# EAGLE design displayshield_v1 (EAGLE 6.3)
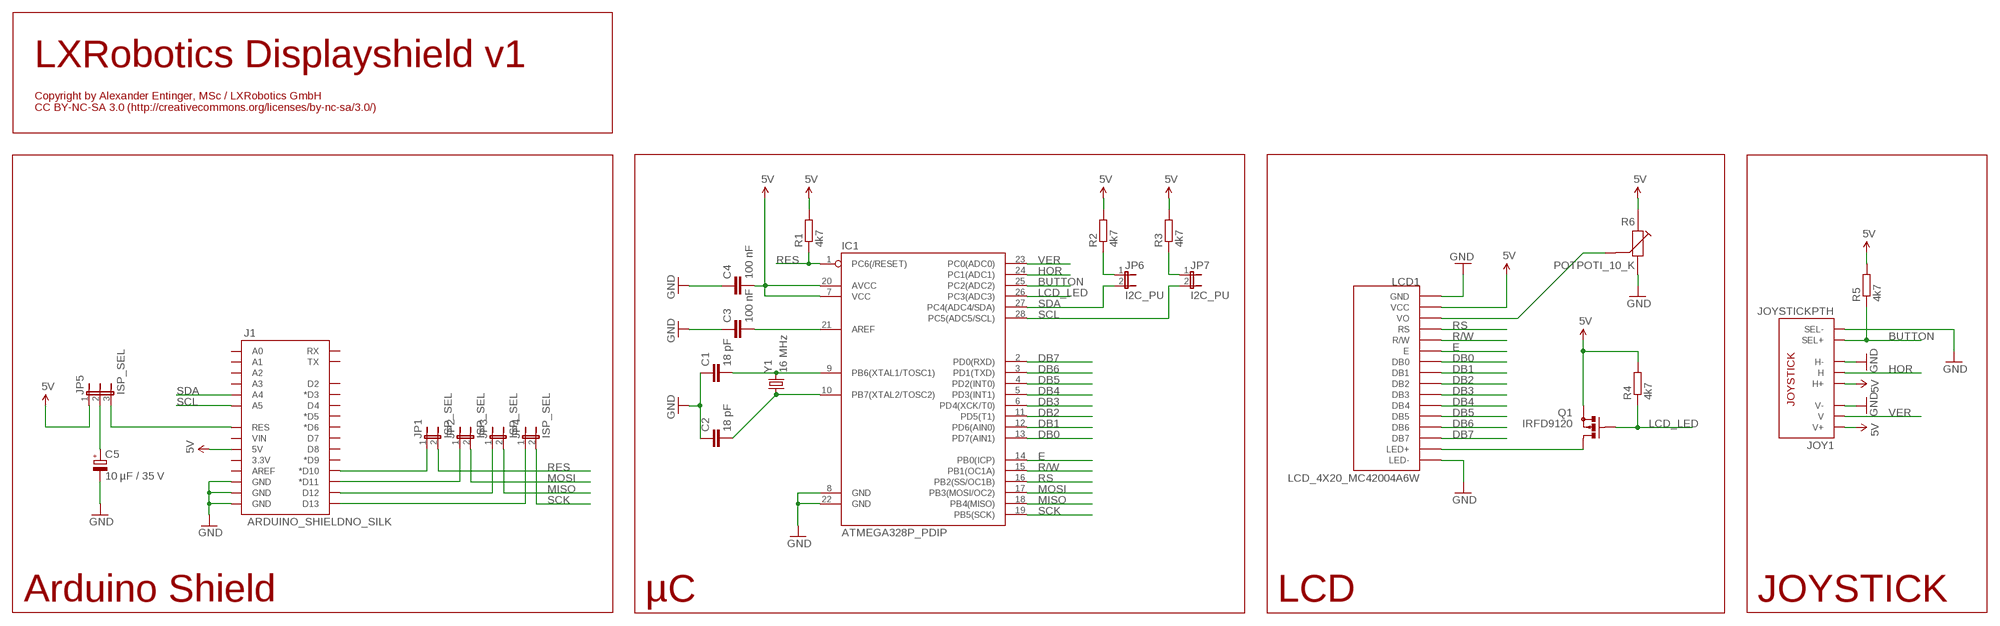
[diagram p0: schematic, sheet 1]

## Parts
C1  18 pF  C-EU025-025X050  [C025-025X050]
C2  18 pF  C-EU025-025X050  [C025-025X050]
C3  100 nF  C-EU025-025X050  [C025-025X050]
C4  100 nF  C-EU025-025X050  [C025-025X050]
C5  10 µF / 35 V  CPOL-EUE2-5  [E2-5]
IC1  ATMEGA328P_PDIP  [DIL28-3]
J1  ARDUINO_SHIELDNO_SILK  [DUEMILANOVE_VIAS]
JOY1  JOYSTICKPTH  [JOYSTICK]
JP1  ISP_SEL  JP1E  [JP1]
JP2  ISP_SEL  JP1E  [JP1]
JP3  ISP_SEL  JP1E  [JP1]
JP4  ISP_SEL  JP1E  [JP1]
JP5  ISP_SEL  JP2E  [JP2]
JP6  I2C_PU  JP1E  [JP1]
JP7  I2C_PU  JP1E  [JP1]
LCD1  LCD_4X20_MC42004A6W  [LCD_3X40_MC42004A6W]
Q1  IRFD9120  [C370-01]
R1  4k7  R-EU_0204/5  [0204/5]
R2  4k7  R-EU_0204/5  [0204/5]
R3  4k7  R-EU_0204/5  [0204/5]
R4  4k7  R-EU_0204/5  [0204/5]
R5  4k7  R-EU_0204/5  [0204/5]
R6  POTPOTI_10_K  [POT_10K]
Y1  16 MHz  CRYSTALHC49US  [HC49US]

## Nets
5V: C4.2 IC1.7(VCC) IC1.20(AVCC) J1.5V JOY1.H1(H+) JOY1.V1(V+) JP5.1 LCD1.VCC Q1.S R1.2 R2.2 R3.2 R4.2 R5.2 R6.S
BUTTON: IC1.25(PC2(ADC2)) JOY1.B1A(SEL+) R5.1
DB0: IC1.13(PD7(AIN1)) LCD1.DB0
DB1: IC1.12(PD6(AIN0)) LCD1.DB1
DB2: IC1.11(PD5(T1)) LCD1.DB2
DB3: IC1.6(PD4(XCK/T0)) LCD1.DB3
DB4: IC1.5(PD3(INT1)) LCD1.DB4
DB5: IC1.4(PD2(INT0)) LCD1.DB5
DB6: IC1.3(PD1(TXD)) LCD1.DB6
DB7: IC1.2(PD0(RXD)) LCD1.DB7
E: IC1.14(PB0(ICP)) LCD1.E
GND: C1.1 C2.1 C3.1 C4.1 C5.- IC1.8(GND) IC1.22(GND) J1.GND@0(GND) J1.GND@1(GND) J1.GND@2(GND) JOY1.B2A(SEL-) JOY1.H3(H-) JOY1.V3(V-) LCD1.GND LCD1.LED- R6.E
HOR: IC1.24(PC1(ADC1)) JOY1.H2(H)
LCD_LED: IC1.26(PC3(ADC3)) Q1.G R4.1
MISO: IC1.18(PB4(MISO)) JP3.2
MOSI: IC1.17(PB3(MOSI/OC2)) JP2.2
N$1: C2.2 IC1.10(PB7(XTAL2/TOSC2)) Y1.1
N$2: C1.2 IC1.9(PB6(XTAL1/TOSC1)) Y1.2
N$3: J1.D10(*D10) JP1.1
N$4: J1.D11(*D11) JP2.1
N$5: C3.2 IC1.21(AREF)
N$6: J1.D12 JP3.1
N$7: J1.D13 JP4.1
N$8: C5.+ JP5.2
N$9: LCD1.LED+ Q1.D Q1.D1(D)
N$10: LCD1.VO R6.VAR
N$11: J1.RES JP5.3
N$12: JP6.1 R2.1
N$13: JP7.1 R3.1
R/W: IC1.15(PB1(OC1A)) LCD1.R/W
RES: IC1.1(PC6(/RESET)) JP1.2 R1.1
RS: IC1.16(PB2(SS/OC1B)) LCD1.RS
SCK: IC1.19(PB5(SCK)) JP4.2
SCL: IC1.28(PC5(ADC5/SCL)) J1.A5 JP7.2
SDA: IC1.27(PC4(ADC4/SDA)) J1.A4 JP6.2
VER: IC1.23(PC0(ADC0)) JOY1.V2(V)
Unconnected: J1.3.3V J1.A0 J1.A1 J1.A2 J1.A3 J1.AREF J1.D2 J1.D3(*D3) J1.D4 J1.D5(*D5) J1.D6(*D6) J1.D7 J1.D8 J1.D9(*D9) J1.RX J1.TX J1.VIN

## Notes on the sheet
- LXRobotics Displayshield v1
- Copyright by Alexander Entinger, MSc / LXRobotics GmbH 
  CC BY-NC-SA 3.0 (http://creativecommons.org/licenses/by-nc-sa/3.0/)
- Arduino Shield | µC | LCD | JOYSTICK

## Library data of the parts
C1-C4 = resistor:C-EU: CAPACITOR, European symbol
C5 = resistor:CPOL-EU: POLARIZED CAPACITOR, European symbol
IC1 = SparkFun-DigitalIC:ATMEGA328P_PDIP: uC used in the Arduino 32kb flash, 1k EEPROM, 2k SRAM This is the through-hole version of this chip.
J1 = SparkFun-Boards:ARDUINO_SHIELD: Arduino shield footprint
JOY1 = SparkFun-Electromechanical:JOYSTICK: Thumb Joystick Joystick commonly found in PS2 controllers. Two pots and a select switch. Footprint proven. Spark Fun Electronics SKU : COM-09032
JP1-JP4 JP6 JP7 = jumper:JP1E: JUMPER
JP5 = jumper:JP2E: JUMPER
LCD1 = lxrobotics:LCD_4X20_MC42004A6W
Q1 = transistor-small-signal:IRFD9120: P-CHANNEL MOS FET
R1-R5 = resistor:R-EU_: RESISTOR, European symbol
R6 = lxrobotics:POT
Y1 = SparkFun-FreqCtrl:CRYSTAL: Various standard crystals. Proven footprints. Spark Fun Electronics SKU : COM-00534

## Board
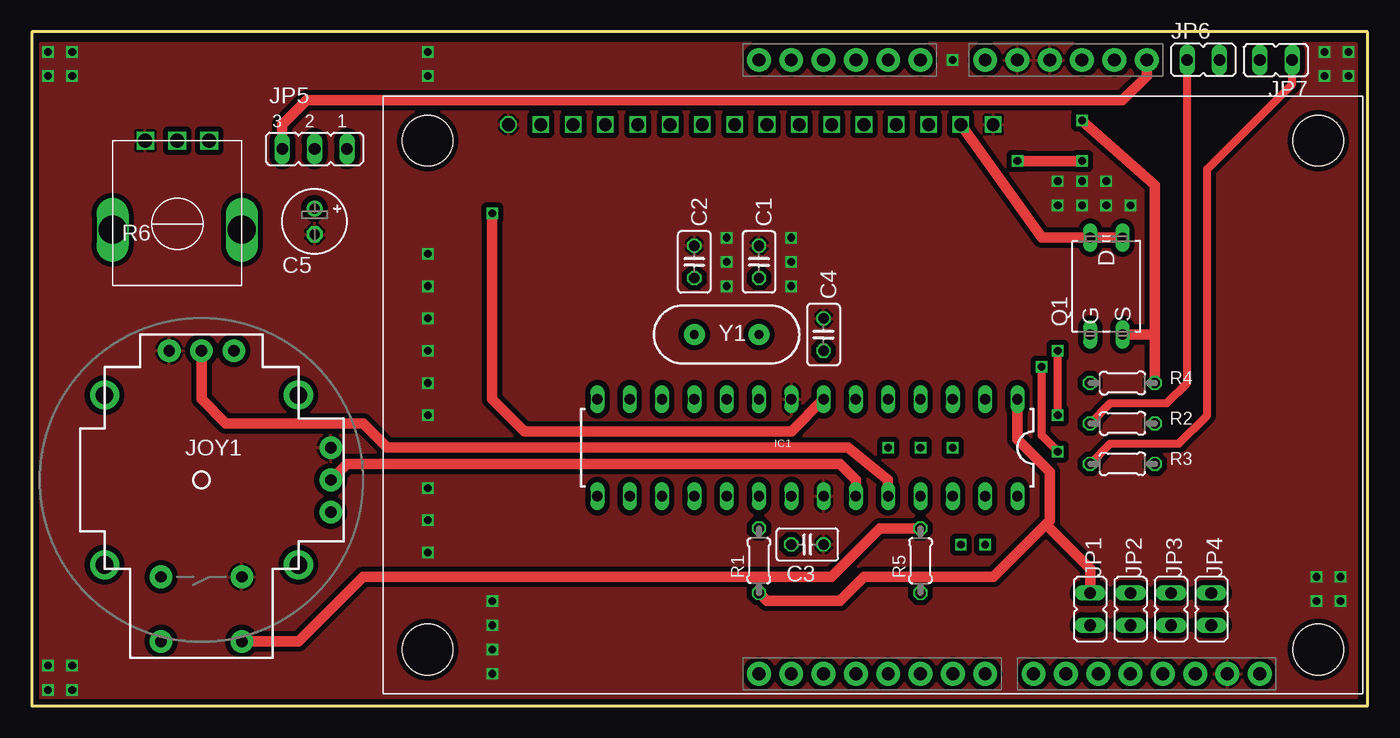
[diagram p1: board, top side]
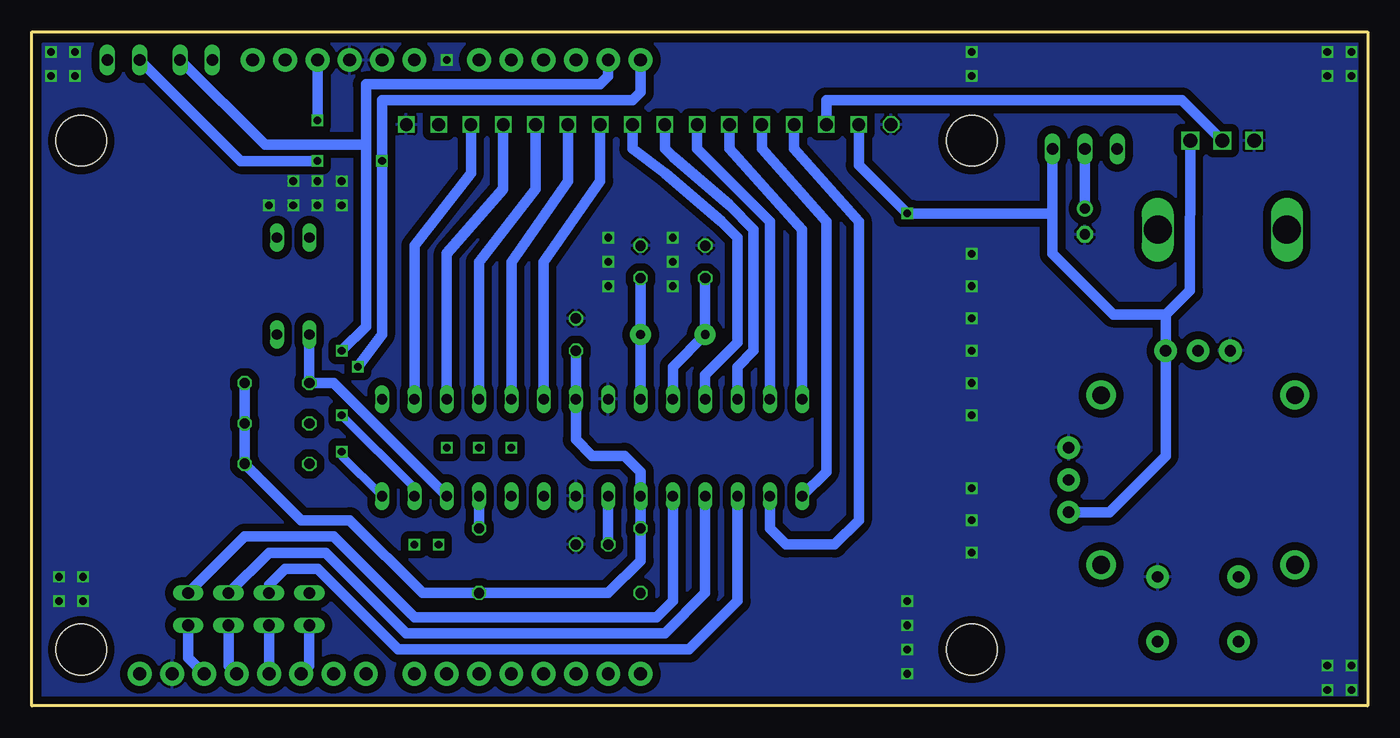
[diagram p2: board, bottom side, seen from below]

Size 105 x 53 mm. Coordinates in mm from the lower left corner, seen from the top.
Outline: 0,0 105,0 105,53 0,53 0,0
Copper layers (1*16): Top 0.035mm / dielectric 1.5mm / Bottom 0.035mm
Design rules "LeitOn - Standard-Eagle-DRU - 1- und  2-Lagen DK - deutsch - Rev 2.0": minimum track width 0.15mm, minimum drill 0.3mm, track to track 0.15mm, track to pad 0.15mm, pad to pad 0.15mm, via to via 0.15mm, smd to smd 0.15mm, copper to edge 0.3mm, drill to drill 0.3mm, minimum pad ring 0.15mm, minimum via ring 0.15mm, stop-mask expansion 0.075mm, vias tented up to drill 0mil, thermal gap 0.2mm

### Footprints (pad centres in the part's own frame; a part is rotated, then mirrored left to right if it is on the bottom)
C025-025X050 = drill 0.813 octagon: 1 -1.27,0; 2 1.27,0
E2-5 = drill 0.813 pad 1.27: + -1.016,0 | drill 0.813 pad 1.27 octagon: - 1.016,0
DIL28-3 = drill 0.813 long: 1 -16.51,-3.81; 2 -13.97,-3.81; 3 -11.43,-3.81; 4 -8.89,-3.81; 5 -6.35,-3.81; 6 -3.81,-3.81; 7 -1.27,-3.81; 8 1.27,-3.81; 9 3.81,-3.81; 10 6.35,-3.81; 11 8.89,-3.81; 12 11.43,-3.81; 13 13.97,-3.81; 14 16.51,-3.81; 15 16.51,3.81; 16 13.97,3.81; 17 11.43,3.81; 18 8.89,3.81; 19 6.35,3.81; 20 3.81,3.81; 21 1.27,3.81; 22 -1.27,3.81; 23 -3.81,3.81; 24 -6.35,3.81; 25 -8.89,3.81; 26 -11.43,3.81; 27 -13.97,3.81; 28 -16.51,3.81
DUEMILANOVE_VIAS = drill 1.016 pad 1.88: 3.3V 50.8,13.97; 5V 50.8,16.51; A0 50.8,29.21; A1 50.8,31.75; A2 50.8,34.29; A3 50.8,36.83; A4 50.8,39.37; A5 50.8,41.91; AREF 2.54,2.54; D2 2.54,36.83; D3 2.54,34.29; D4 2.54,31.75; D5 2.54,29.21; D6 2.54,26.67; D7 2.54,24.13; D8 2.54,20.32; D9 2.54,17.78; D10 2.54,15.24; D11 2.54,12.7; D12 2.54,10.16; D13 2.54,7.62; GND@0 50.8,19.05; GND@1 50.8,21.59; GND@2 2.54,5.08; RES 50.8,11.43; RX 2.54,41.91; TX 2.54,39.37; VIN 50.8,24.13
JOYSTICK = drill 0.9 pad 1.778: B1A -3.175,12.7; B1B 3.175,12.7; B2A -3.175,7.62; B2B 3.175,7.62 | drill 0.889 pad 1.778: H1 -2.54,-10.16; H2 0,-10.16; H3 2.54,-10.16; V1 -10.16,2.54; V2 -10.16,0; V3 -10.16,-2.54 | drill 1.397 pad 2.286: MOUNT1 -7.62,6.668; MOUNT2 -7.62,-6.668; MOUNT3 7.62,-6.668; MOUNT4 7.62,6.668
JP1 = drill 0.914 long: 1 0,-1.27; 2 0,1.27
JP2 = drill 0.914 long: 1 -2.54,0; 2 0,0; 3 2.54,0
LCD_3X40_MC42004A6W = drill 1 square: DB0 -2.54,1.27; DB1 0,1.27; DB2 2.54,1.27; DB3 5.08,1.27; DB4 7.62,1.27; DB5 10.16,1.27; DB6 12.7,1.27; DB7 15.24,1.27; E -5.08,1.27; LED+ 17.78,1.27; LED- 20.32,1.27; R/W -7.62,1.27; RS -10.16,1.27; VCC -15.24,1.27; VO -12.7,1.27 | drill 1 octagon: GND -17.78,1.27 | hole 4: -24.13,0; 45.87,0; -24.13,-40; 45.87,-40
C370-01 = drill 0.813 long: D -3.81,1.27; D1 -3.81,-1.27; G 3.81,-1.27; S 3.81,1.27
0204/5 = drill 0.813 octagon: 1 -2.54,0; 2 2.54,0
POT_10K = drill 1.1 square: E 2.5,0; S -2.5,0; VAR 0,0 | drill 2.2 long: P$1 -5.08,7; P$2 5.08,7
HC49US = drill 0.7 pad 1.651: 1 -2.54,0; 2 2.54,0

### Placement (x,y rotation side)
C1  57.15,34.91 270 top
C2  52.07,34.91 270 top
C3  60.96,12.68 180 top
C4  62.23,29.2 270 top
C5  22.23,38.09 270 top
IC1  60.96,20.3 180 top
J1  99.06,-0.01 90 top
JOY1  13.34,17.77 180 top
JP1  83.19,7.61 0 top
JP2  86.36,7.61 0 top
JP3  89.53,7.61 0 top
JP4  92.71,7.61 0 top
JP5  22.23,43.8 180 top
JP6  92.08,50.78 270 top
JP7  97.79,50.78 90 top
LCD1  55.24,44.44 0 top
Q1  84.45,33.01 270 top
R1  57.15,11.41 90 top
R2  85.72,22.21 0 top
R3  85.72,19.04 0 top
R4  85.72,25.38 0 top
R5  69.85,11.41 270 top
R6  11.43,44.44 180 top
Y1  54.61,29.2 0 top

### Tracks (layer width: path | path; a pad name or v marks a point on that pad's centre or on a via)
5V  (via drill 0.6)
  Top 0.813: v36.2,38.72 36.2,24.11 38.73,21.57 59.69,21.57 IC1.7 | v82.55,46.02 88.27,40.94 88.27,29.2 | 88.27,29.2 R4.2 | Q1.S 88.27,29.2
  Bottom 0.813: R4.2 R2.2 R3.2 83.82,14.59 80.01,14.59 74.3,8.88 R5.2 59.69,8.88 57.15,11.41 R1.2 IC1.20 57.15,18.4 58.42,19.67 60.96,19.67 62.23,20.94 IC1.7 C4.2 | JOY1.V1 20.32,15.23 15.88,19.67 JOY1.H1 15.88,30.78 | 15.88,30.78 13.97,32.65 R6.S | JP5.1 24.77,38.72 | 24.77,38.72 24.77,35.55 20,30.78 15.88,30.78 | LCD1.VCC 40.01,42.53 v36.2,38.72 24.77,38.72 | J1.5V v82.55,46.02
BUTTON
  Top 0.813: R5.1 66.67,13.95 62.87,10.14 26.04,10.14 20.95,5.06 JOY1.B1A
  Bottom 0.813: R5.1 IC1.25
DB0
  Bottom 0.813: LCD1.DB0 52.7,43.8 46.99,38.09 IC1.13
DB1
  Bottom 0.813: LCD1.DB1 55.24,43.8 54.61,43.16 50.16,39.35 48.26,37.45 48.26,27.92 49.53,26.66 IC1.12
DB2
  Bottom 0.813: LCD1.DB2 57.78,43.8 55.24,41.9 50.8,38.09 49.53,36.81 49.53,28.56 52.07,26.02 IC1.11
DB3
  Bottom 0.813: IC1.6 64.77,34.91 60.33,41.26 LCD1.DB3
DB4
  Bottom 0.813: IC1.5 67.31,34.91 62.87,41.26 LCD1.DB4
DB5
  Bottom 0.813: IC1.4 69.85,34.91 65.41,40.62 LCD1.DB5
DB6
  Bottom 0.813: IC1.3 72.39,35.55 67.94,40.62 LCD1.DB6
DB7
  Bottom 0.813: IC1.2 74.93,36.18 70.48,41.9 LCD1.DB7
E
  Bottom 0.813: LCD1.E 50.16,43.8 44.45,37.45 IC1.14
GND  (via drill 0.6)
  other vias: 1.27,51.42 3.17,51.42 3.17,49.52 1.27,49.52 1.27,3.16 3.17,3.16 3.17,1.26 1.27,1.26 36.2,2.53 36.2,4.43 36.2,6.34 36.2,8.24 31.11,12.05 31.11,14.59 31.11,17.13 31.11,22.84 31.11,25.38 31.11,27.92 31.11,30.47 31.11,33.01 31.11,35.55 31.11,49.52 31.11,51.42 72.39,50.78 86.36,39.35 80.64,41.26 80.64,39.35 82.55,39.35 82.55,41.26 84.45,41.26 84.45,39.35 101.6,51.42 103.5,51.42 103.5,49.52 101.6,49.52 54.61,36.81 54.61,34.91 54.61,33.01 59.69,33.01 59.69,34.91 59.69,36.81 102.87,10.14 102.87,8.24 100.97,8.24 100.97,10.14
  pour Bottom (isolate 0.61): 0.64,0.62 104.14,0.62 104.14,52.05 0.64,52.05
  pour Top (isolate 0.406): 0.64,0.62 104.14,0.62 104.14,52.05 0.64,52.05
HOR
  Top 0.813: IC1.24 67.31,17.77 64.14,20.3 27.94,20.3 26.04,22.21 15.24,22.21 13.34,24.11 JOY1.H2
LCD_LED
  Bottom 0.813: IC1.26 81.28,25.38 R4.1 Q1.G
MISO
  Bottom 0.813: JP3.2 86.36,12.05 81.92,12.05 75.56,5.7 55.24,5.7 52.07,8.88 IC1.18
MOSI
  Bottom 0.813: JP2.2 86.36,9.51 85.09,10.78 82.55,10.78 76.2,4.43 53.34,4.43 49.53,8.24 IC1.17
N$1
  Bottom 0.813: IC1.10 54.61,26.66 Y1.1 C2.2
N$2
  Bottom 0.813: C1.2 Y1.2 IC1.9
N$3
  Bottom 0.813: J1.D10 83.19,3.16 JP1.1
N$4
  Bottom 0.813: JP2.1 J1.D11
N$5
  Bottom 0.813: IC1.21 C3.2
N$6
  Bottom 0.813: JP3.1 89.53,3.16 J1.D12
N$7
  Bottom 0.813: JP4.1 92.71,3.79 J1.D13
N$8
  Bottom 0.813: JP5.2 C5.+
N$9
  Top 0.813: Q1.D Q1.D1 79.38,36.81 LCD1.LED+
N$10
  Bottom 0.813: LCD1.VO 42.55,47.61 14.61,47.61 R6.VAR
N$11
  Top 0.813: J1.RES 87.63,49.52 85.72,47.61 21.59,47.61 19.68,45.7 JP5.3
N$12
  Top 0.61: R2.1 84.77,23.8 89.22,23.8 90.81,25.38 JP6.1
N$13
  Top 0.61: R3.1 84.77,20.62 90.17,20.62 92.39,22.84 92.39,42.21 99.06,48.88 JP7.1
N$43  (via drill 0.6)
  other vias: 73.03,12.68
N$44  (via drill 0.6)
  other vias: 74.93,12.68
N$45  (via drill 0.6)
  other vias: 67.31,20.3
N$46  (via drill 0.6)
  other vias: 69.85,20.3
N$47  (via drill 0.6)
  other vias: 72.39,20.3
R/W
  Bottom 0.813: LCD1.R/W 47.62,43.8 42.55,38.09 42.55,18.4 IC1.15
RES
  Top 0.813: 79.69,14.27 80.01,14.59 80.01,18.4 77.47,20.94 IC1.1 | 79.69,14.27 75.56,10.14 65.41,10.14 63.5,8.24 57.78,8.24 R1.1 | JP1.2 83.19,10.78 79.69,14.27
RS
  Bottom 0.813: LCD1.RS 45.09,43.8 40.01,38.09 40.01,14.59 41.91,12.68 45.72,12.68 46.99,13.95 IC1.16
SCK
  Bottom 0.813: JP4.2 88.27,13.32 81.28,13.32 74.93,6.97 55.88,6.97 54.61,8.24 IC1.19
SCL  (via drill 0.6)
  Top 0.61: v80.64,19.99 79.38,21.26 v79.38,26.66
  Top 0.813: v82.55,42.85 v77.47,42.85
  Bottom 0.61: IC1.28 80.64,19.67 v80.64,19.99
  Bottom 0.813: J1.A5 57.15,48.24 57.78,47.61 77.47,47.61 v77.47,42.85 77.47,29.2 v79.38,26.66 | JP7.2 88.58,42.85 v82.55,42.85
SDA  (via drill 0.6)
  Top 0.61: v80.64,22.84 v80.64,27.92
  Bottom 0.61: IC1.27 74.93,17.13 v80.64,22.84
  Bottom 0.813: J1.A4 59.69,49.52 60.33,48.88 78.74,48.88 78.74,44.12 | 78.74,44.12 78.74,29.83 v80.64,27.92 | JP6.2 86.68,44.12 78.74,44.12
VER
  Top 0.813: JOY1.V2 24.77,19.04 63.5,19.04 64.77,17.77 IC1.23